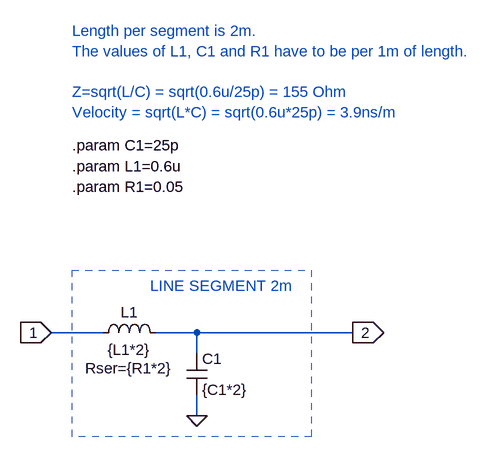
[diagram p0: schematic line_2m.asc]
line_2m.asc, the LTspice schematic file:
Version 4
SHEET 1 880 680
WIRE -144 224 -80 224
WIRE -80 320 -80 352
WIRE -224 224 -304 224
WIRE -80 224 160 224
WIRE -80 256 -80 224
FLAG -80 352 0
FLAG -304 224 1
IOPIN -304 224 In
FLAG 160 224 2
IOPIN 160 224 Out
SYMBOL ind -240 240 R270
WINDOW 0 32 56 VTop 0
WINDOW 3 5 56 VBottom 0
WINDOW 39 -23 56 VBottom 0
SYMATTR InstName L1
SYMATTR Value {L1*2}
SYMATTR SpiceLine Rser={R1*2}
SYMBOL cap -96 256 R0
SYMATTR InstName C1
SYMATTR Value {C1*2}
TEXT -272 -64 Left 0 !.param C1=25p
TEXT -272 -32 Left 0 !.param L1=0.6u
TEXT -272 -240 Left 0 ;Length per segment is 2m.\nThe values of L1, C1 and R1 have to be per 1m of length.\n \nZ=sqrt(L/C) = sqrt(0.6u/25p) = 155 Ohm\nVelocity = sqrt(L*C) = sqrt(0.6u*25p) = 3.9ns/m
TEXT -152 152 Left 0 ;LINE SEGMENT 2m
TEXT -272 0 Left 0 !.param R1=0.05
RECTANGLE Normal 96 384 -272 128 2

The netlist it stands for:
* line_2m.asc
L1 1 2 {L1*2} Rser={R1*2}
C1 2 0 {C1*2}
.param C1=25p
.param L1=0.6u
* Length per segment is 2m.
* The values of L1, C1 and R1 have to be per 1m of length.
* Z=sqrt(L/C) = sqrt(0.6u/25p) = 155 Ohm
* Velocity = sqrt(L*C) = sqrt(0.6u*25p) = 3.9ns/m
* LINE SEGMENT 2m
.param R1=0.05
.backanno
.end